# Altium schematic sheet eMMC Memory.SchDoc
size A4; SheetNumber: 7; SheetTotal: 16
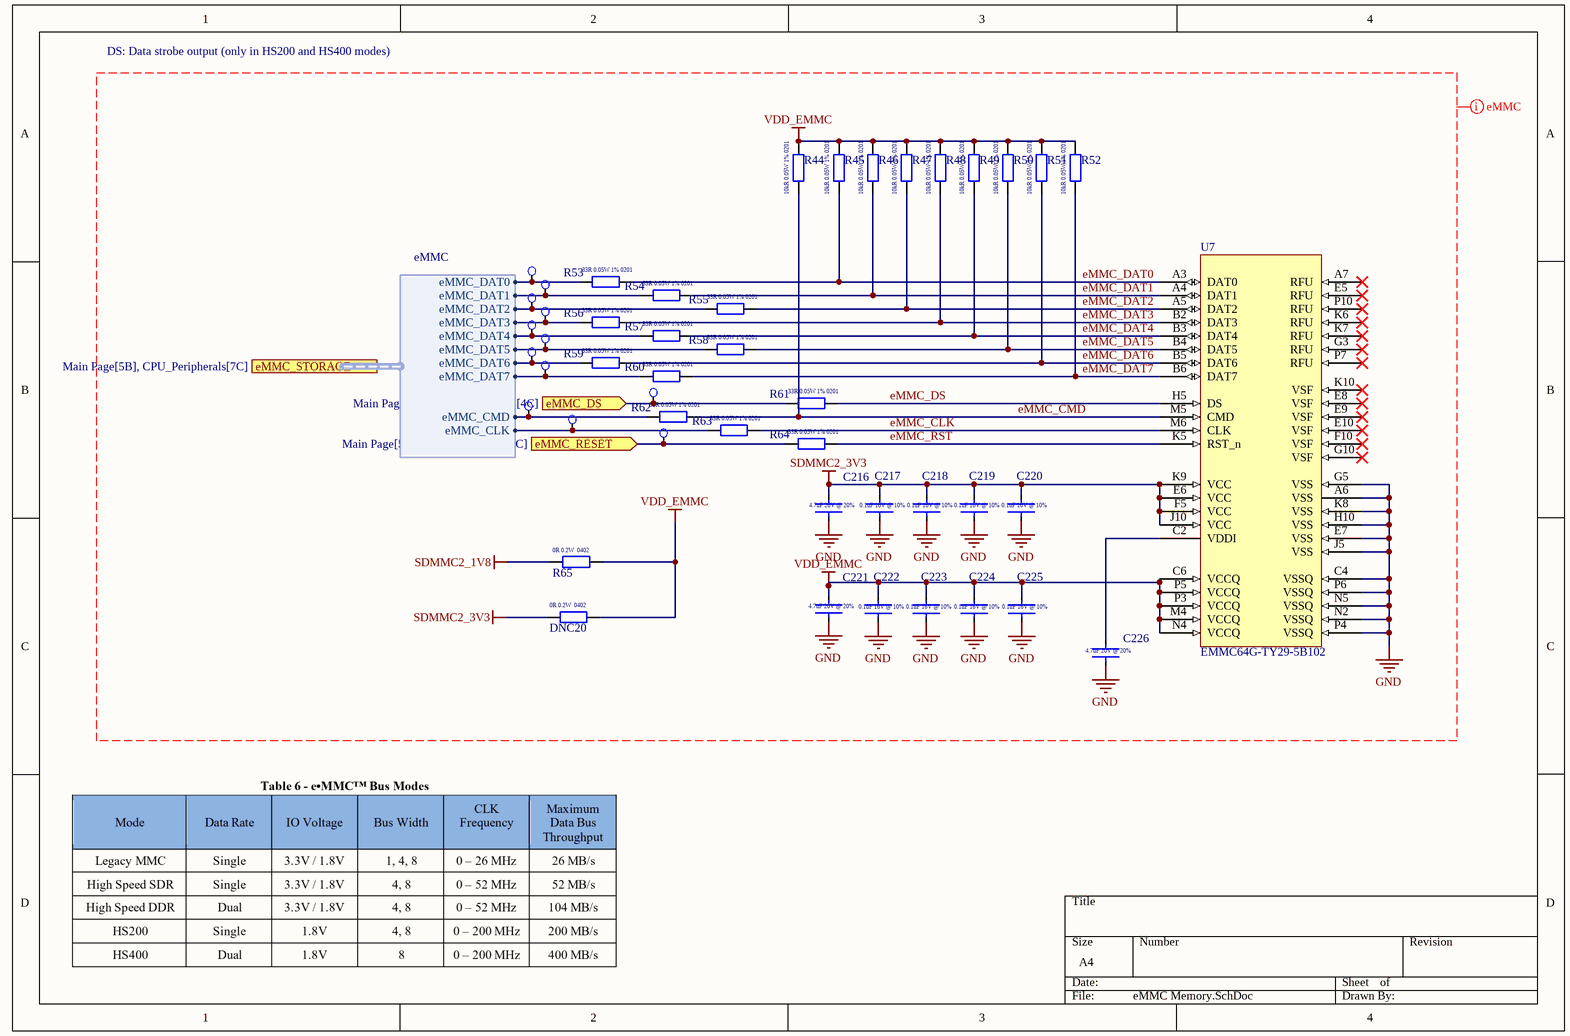
[diagram p0: eMMC Memory.SchDoc]

## Parts
C216  4.7uF  [CAPC1005X06L]  (value not drawn)
C217  0.1uF  [CAPC0603X03L]  (value not drawn)
C218  0.1uF  [CAPC0603X03L]  (value not drawn)
C219  0.1uF  [CAPC0603X03L]  (value not drawn)
C220  0.1uF  [CAPC0603X03L]  (value not drawn)
C221  4.7uF  [CAPC1005X06L]  (value not drawn)
C222  0.1uF  [CAPC0603X03L]  (value not drawn)
C223  0.1uF  [CAPC0603X03L]  (value not drawn)
C224  0.1uF  [CAPC0603X03L]  (value not drawn)
C225  0.1uF  [CAPC0603X03L]  (value not drawn)
C226  4.7uF  [CAPC1005X06L]  (value not drawn)
DNC20  CRCW04020000Z0EDHP  [RESC1005X04L]  (value not drawn)
R44  ERJ-1GNF1002C  [RESC0603X03L]  (value not drawn)
R45  ERJ-1GNF1002C  [RESC0603X03L]  (value not drawn)
R46  ERJ-1GNF1002C  [RESC0603X03L]  (value not drawn)
R47  ERJ-1GNF1002C  [RESC0603X03L]  (value not drawn)
R48  ERJ-1GNF1002C  [RESC0603X03L]  (value not drawn)
R49  ERJ-1GNF1002C  [RESC0603X03L]  (value not drawn)
R50  ERJ-1GNF1002C  [RESC0603X03L]  (value not drawn)
R51  ERJ-1GNF1002C  [RESC0603X03L]  (value not drawn)
R52  ERJ-1GNF1002C  [RESC0603X03L]  (value not drawn)
R53  ERJ-1GNF33R0C  [RESC0603X03L]  (value not drawn)
R54  ERJ-1GNF33R0C  [RESC0603X03L]  (value not drawn)
R55  ERJ-1GNF33R0C  [RESC0603X03L]  (value not drawn)
R56  ERJ-1GNF33R0C  [RESC0603X03L]  (value not drawn)
R57  ERJ-1GNF33R0C  [RESC0603X03L]  (value not drawn)
R58  ERJ-1GNF33R0C  [RESC0603X03L]  (value not drawn)
R59  ERJ-1GNF33R0C  [RESC0603X03L]  (value not drawn)
R60  ERJ-1GNF33R0C  [RESC0603X03L]  (value not drawn)
R61  ERJ-1GNF33R0C  [RESC0603X03L]  (value not drawn)
R62  ERJ-1GNF33R0C  [RESC0603X03L]  (value not drawn)
R63  ERJ-1GNF33R0C  [RESC0603X03L]  (value not drawn)
R64  ERJ-1GNF33R0C  [RESC0603X03L]  (value not drawn)
R65  CRCW04020000Z0EDHP  [RESC1005X04L]  (value not drawn)
TP7  Test Point  [Test Point]  (value not drawn)
TP8  Test Point  [Test Point]  (value not drawn)
TP9  Test Point  [Test Point]  (value not drawn)
TP10  Test Point  [Test Point]  (value not drawn)
TP11  Test Point  [Test Point]  (value not drawn)
TP12  Test Point  [Test Point]  (value not drawn)
TP13  Test Point  [Test Point]  (value not drawn)
TP14  Test Point  [Test Point]  (value not drawn)
TP15  Test Point  [Test Point]  (value not drawn)
TP16  Test Point  [Test Point]  (value not drawn)
TP17  Test Point  [Test Point]  (value not drawn)
TP18  Test Point  [Test Point]  (value not drawn)
U7  EMMC64G-TY29-5B102  [EMMC64G-TY29-5B102]

## Ports
eMMC_DS (in, see Main Page[5B], CPU_Peripherals[4C]), eMMC_RESET (in, see Main Page[5B], CPU_Peripherals[4C]), eMMC_STORAGE (harness eMMC, see Main Page[5B], CPU_Peripherals[7C])

## Harnesses
eMMC: eMMC_DAT0, eMMC_DAT1, eMMC_DAT2, eMMC_DAT3, eMMC_DAT4, eMMC_DAT5, eMMC_DAT6, eMMC_DAT7, eMMC_CMD, eMMC_CLK

## Nets
GND: C216.1 C217.1 C218.1 C219.1 C220.1 C221.1 C222.1 C223.1 C224.1 C225.1 C226.1 U7.A6(VSS) U7.C4(VSSQ) U7.E7(VSS) U7.G5(VSS) U7.H10(VSS) U7.J5(VSS) U7.K8(VSS) U7.N2(VSSQ) U7.N5(VSSQ) U7.P4(VSSQ) U7.P6(VSSQ)
SDMMC2_1V8: R65.1
SDMMC2_3V3: C216.2 C217.2 C218.2 C219.2 C220.2 DNC20.1 U7.E6(VCC) U7.F5(VCC) U7.J10(VCC) U7.K9(VCC)
VDD_EMMC: C221.2 C222.2 C223.2 C224.2 C225.2 DNC20.2 R44.2 R45.2 R46.2 R47.2 R48.2 R49.2 R50.2 R51.2 R52.2 R65.2 U7.C6(VCCQ) U7.M4(VCCQ) U7.N4(VCCQ) U7.P3(VCCQ) U7.P5(VCCQ)
eMMC_CLK: R63.2 U7.M6(CLK)
eMMC_CMD: R44.1 R62.2 U7.M5(CMD)
eMMC_DAT0: R45.1 R53.2 U7.A3(DAT0)
eMMC_DAT1: R46.1 R54.2 U7.A4(DAT1)
eMMC_DAT2: R47.1 R55.2 U7.A5(DAT2)
eMMC_DAT3: R48.1 R56.2 U7.B2(DAT3)
eMMC_DAT4: R49.1 R57.2 U7.B3(DAT4)
eMMC_DAT5: R50.1 R58.2 U7.B4(DAT5)
eMMC_DAT6: R51.1 R59.2 U7.B5(DAT6)
eMMC_DAT7: R52.1 R60.2 U7.B6(DAT7)
eMMC_DS: R61.2 U7.H5(DS)
eMMC_DS: R61.1 TP15.12 ; port eMMC_DS  [a separate net that carries the same name]
eMMC_RESET: R64.1 TP18.12 ; port eMMC_RESET
eMMC_RST: R64.2 U7.K5(RST_n)
NetC226_2: C226.2 U7.C2(VDDI)
NetR53_1: R53.1 TP7.12 ; port eMMC_STORAGE.eMMC_DAT0
NetR54_1: R54.1 TP8.12 ; port eMMC_STORAGE.eMMC_DAT1
NetR55_1: R55.1 TP9.12 ; port eMMC_STORAGE.eMMC_DAT2
NetR56_1: R56.1 TP10.12 ; port eMMC_STORAGE.eMMC_DAT3
NetR57_1: R57.1 TP11.12 ; port eMMC_STORAGE.eMMC_DAT4
NetR58_1: R58.1 TP12.12 ; port eMMC_STORAGE.eMMC_DAT5
NetR59_1: R59.1 TP13.12 ; port eMMC_STORAGE.eMMC_DAT6
NetR60_1: R60.1 TP14.12 ; port eMMC_STORAGE.eMMC_DAT7
NetR62_1: R62.1 TP16.12 ; port eMMC_STORAGE.eMMC_CMD
NetR63_1: R63.1 TP17.12 ; port eMMC_STORAGE.eMMC_CLK

Not connected (* = marked no-connect by the designer): U7 A7(RFU)* E5(RFU)* E8(VSF)* E9(VSF)* E10(VSF)* F10(VSF)* G3(RFU)* G10(VSF)* K6(RFU)* K7(RFU)* K10(VSF)* P7(RFU)* P10(RFU)*

## Layout directives
net class eMMC: eMMC_CLK, eMMC_CMD, eMMC_DAT0, eMMC_DAT1, eMMC_DAT2, eMMC_DAT3, eMMC_DAT4, eMMC_DAT5, eMMC_DAT6, eMMC_DAT7, eMMC_DS, eMMC_RST, GND, SDMMC2_1V8, SDMMC2_3V3, VDD_EMMC

## Notes on the sheet
- DS: Data strobe output (only in HS200 and HS400 modes)
- (in symbol CL05A475MO5NUNC) 4.7uF 20V @ 20%
- (in symbol CRCW04020000Z0EDHP) 0R 0.2W  0402
- (in symbol ERJ-1GNF33R0C) 33R 0.05W 1% 0201
- (in symbol ERJ-1GNF1002C) 10kR 0.05W 1% 0201
- (in symbol GRM033R61E104KE14J) 0.1uF 16V @ 10%

## Library data of the parts
C216 C221 C226 = CL05A475MO5NUNC: 4.7 µF ±20% 16V Ceramic Capacitor X5R 0402 (1005 Metric)
C217-C220 C222-C225 = GRM033R61E104KE14J: 0.1 µF ±10% 25V Ceramic Capacitor X5R 0201 (0603 Metric)0.1 µF ±10% 25V Ceramic Capacitor X5R 0201 (0603 Metric)
DNC20 R65 = CRCW04020000Z0EDHP: 0 Ohms Jumper Chip Resistor 0402 (1005 Metric) Automotive AEC-Q200, Pulse Withstanding Thick Film; ComponentLink1Description: New link; ComponentLink1URL: https://www.digikey.com.au/en/products/detail/vishay-dale/CRCW04020000Z0EDHP/2222496
R44-R52 = ERJ-1GNF1002C: 10 kOhms ±1% 0.05W, 1/20W Chip Resistor 0201 (0603 Metric) Thick Film; ComponentLink1Description: New link; ComponentLink1URL: https://www.digikey.com.au/en/products/detail/panasonic-electronic-components/ERJ-1GNF1002C/2036226
R53-R64 = ERJ-1GNF33R0C: 33 Ohms ±1% 0.05W, 1/20W Chip Resistor 0201 (0603 Metric) Thick Film; ComponentLink1Description: New link; ComponentLink1URL: https://www.digikey.com.au/en/products/detail/panasonic-electronic-components/ERJ-1GNF33R0C/2035941
U7 = EMMC64G-TY29-5B102: eMMC pSLC eMMC 5.1 (HS400) 153B 64GB; ComponentLink1Description: New link; ComponentLink1URL: https://www.digikey.com.au/en/products/detail/kingston-technology/EMMC64G-TY29-5B102/23544210?srsltid=AfmBOoplT4W8nAr74tqJNFMNLtQIICeKqThZaKy8fUOfiCqFJlsEGKlk